# Altium schematic sheet input_output.SchDoc
size A4; SheetNumber: 2; SheetTotal: 6
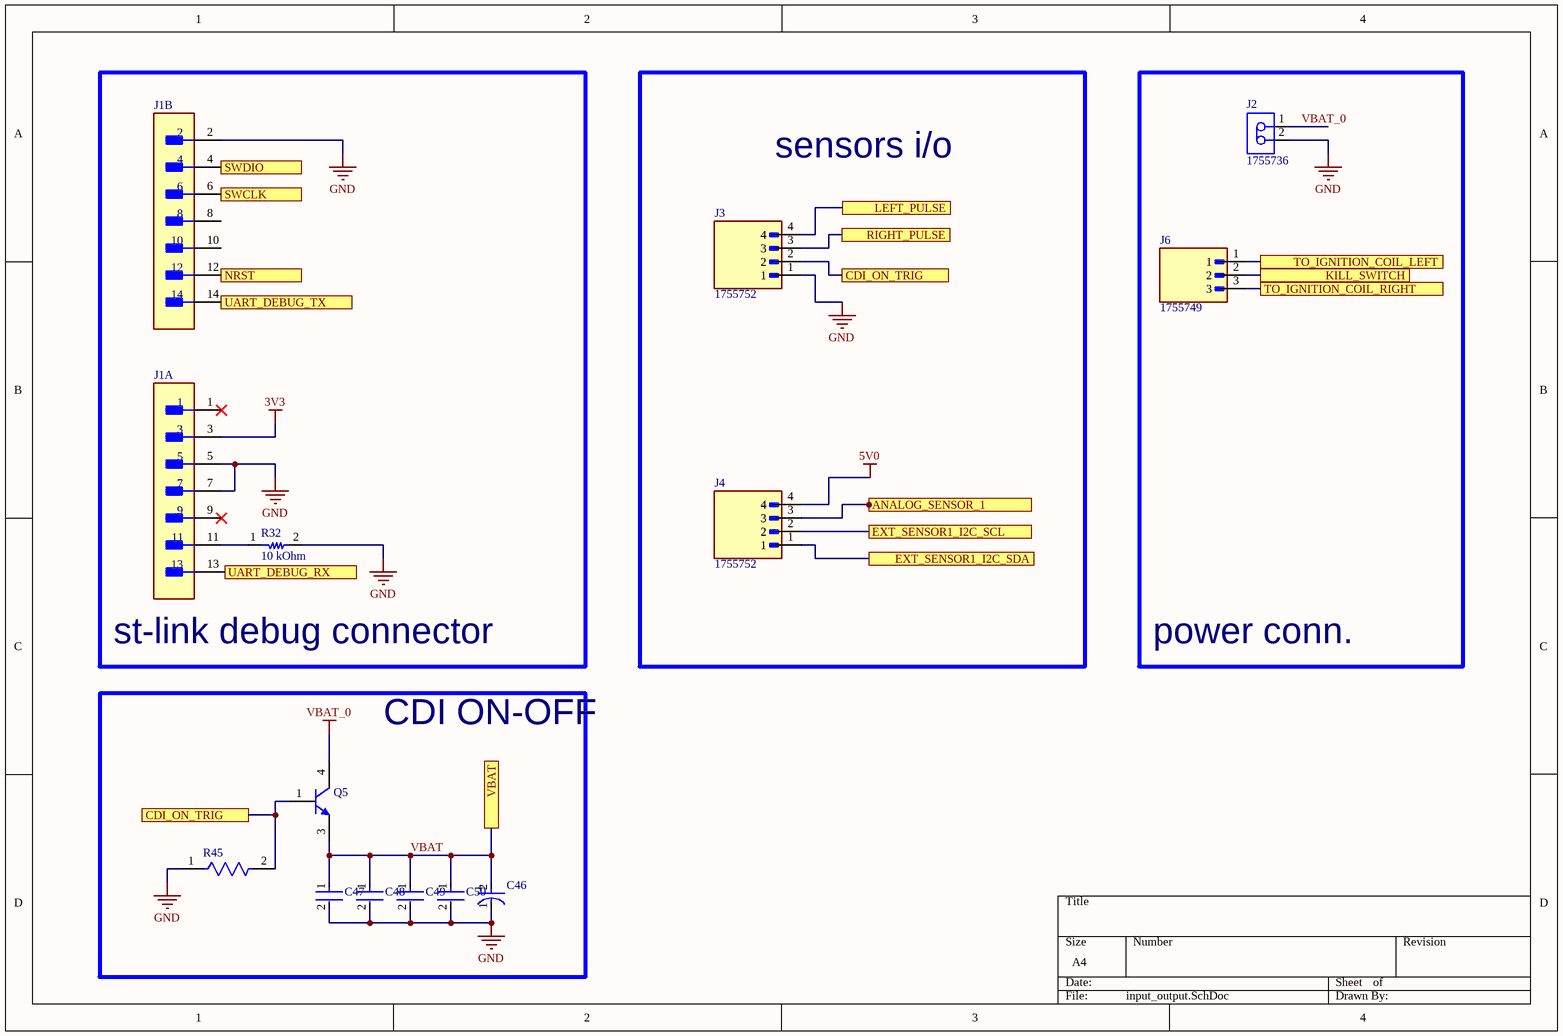
[diagram p0: input_output.SchDoc]

## Parts
C46  EEEFT1E471AP  [FP-FTF-MFG]  (value not drawn)
C47  C1206X104J3GACTU  [FP-C1206X104J3GACTU-MFG]  (value not drawn)
C48  C1206X104J3GACTU  [FP-C1206X104J3GACTU-MFG]  (value not drawn)
C49  C1206X104J3GACTU  [FP-C1206X104J3GACTU-MFG]  (value not drawn)
C50  C1206X104J3GACTU  [FP-C1206X104J3GACTU-MFG]  (value not drawn)
J1  FTSH-107-01-F-DV-K  [FP-FTSH-107-01-F-DV-K-MFG]  (value not drawn)  (parts A,B of 2)
J2  1755736  [PHOE-1755736-2_V]
J3  1755752  [PHOENIX_1755752]
J4  1755752  [PHOENIX_1755752]
J6  1755749  [PHOENIX_1755749]
Q5  MJD3055T4G  [ONSC-DPAK-3-369C-01_V]  (value not drawn)
R32  value 10 kOhm  [0603_FP]  (hidden comment: Resistor_0603)
R45  CRGP0805F10K  [FP-CRGP0805-IPC_C]  (value not drawn)

## Blocks framed on the sheet
st-link debug connector: J1 R32
sensors i/o: J3 J4
power conn.: J2 J6
CDI ON-OFF: C46-C50 Q5 R45

## Ports
ANALOG_SENSOR_1 (see logic[1A]), CDI_ON_TRIG (see input_output[1D]), CDI_ON_TRIG (see input_output[3B]), EXT_SENSOR1_I2C_SCL (see logic[3A]), EXT_SENSOR1_I2C_SDA (see logic[3A]), KILL_SWITCH (see logic[3B]), LEFT_PULSE (see input_signal_conditioning[1B]), NRST (see logic[3B]), RIGHT_PULSE (see input_signal_conditioning[1C]), SWCLK (see logic[1B]), SWDIO (see logic[1B]), TO_IGNITION_COIL_LEFT (see cd_switching[6B]), TO_IGNITION_COIL_RIGHT (see cd_switching[6C]), UART_DEBUG_RX (see logic[1B]), UART_DEBUG_TX (see logic[1B]), VBAT (see HV_power[1C], LV_power[1B])

## Nets
3V3: J1.3
5V0: J4.4
GND: C46.1(C) C47.2 C48.2 C49.2 C50.2 J1.2 J1.5 J1.7 J2.2 J3.1 R32.2 R45.1
VBAT_0: J2.1 Q5.4(C)
ANALOG_SENSOR_1: J4.3 ; port ANALOG_SENSOR_1
CDI_ON_TRIG: J3.2 Q5.1(B) R45.2 ; port CDI_ON_TRIG
EXT_SENSOR1_I2C_SCL: J4.2 ; port EXT_SENSOR1_I2C_SCL
EXT_SENSOR1_I2C_SDA: J4.1 ; port EXT_SENSOR1_I2C_SDA
KILL_SWITCH: J6.2 ; port KILL_SWITCH
LEFT_PULSE: J3.4 ; port LEFT_PULSE
NRST: J1.12 ; port NRST
RIGHT_PULSE: J3.3 ; port RIGHT_PULSE
SWCLK: J1.6 ; port SWCLK
SWDIO: J1.4 ; port SWDIO
TO_IGNITION_COIL_LEFT: J6.1 ; port TO_IGNITION_COIL_LEFT
TO_IGNITION_COIL_RIGHT: J6.3 ; port TO_IGNITION_COIL_RIGHT
UART_DEBUG_RX: J1.13 ; port UART_DEBUG_RX
UART_DEBUG_TX: J1.14 ; port UART_DEBUG_TX
VBAT: C46.2(A) C47.1 C48.1 C49.1 C50.1 Q5.3(E) ; port VBAT
NetJ1_11: J1.11 R32.1

Not connected (* = marked no-connect by the designer): J1 1* 8 9* 10

## Notes on the sheet
- (in symbol CMP-05427-000040-1) +

## Library data of the parts
C46 = CMP-05427-000040-1: CAP ALUM 470UF 20% 25V SMD; ESR (Equivalent Series Resistance): 80mR; Dielectric Material: Aluminium; Lead Diameter: 0.9mm; Ripple Current: 850mA; Leakage Current: 117.5uA; Life (Hours): 2000Hour; Lead Free: Lead Free; Height - Seated (Max): 0.413inch; Contact Plating: Tin; Voltage: 25V; Package Quantity: 500; REACH SVHC: No SVHC; Diameter: 8mm; Features: General Purpose; Voltage Rating: 25V; Radiation Hardening: No; Number of Pins: 2; Length: 10.2mm; Max Operating Temperature: 105°C; Tolerance: 20%; Lead Pitch: 3.1mm; Voltage Rating (DC): 25V; Packaging: Tape and Reel; RoHS Compliant: Yes; Series: FT; Height: 10.2mm; Capacitance: 470uF; Construction: Cylindrical; Case/Package: Radial; Mount: Surface Mount; Termination: SMD/SMT; Min Operating Temperature: -55°C; Ripple Current (AC): 850mA
C47-C50 = CMP-03020-034648-1: CAP CER 0.1UF 25V C0G/NP0 1206; RoHS Compliant: Yes
J1 = CMP-02766-001448-1: CONN HEADER SMD 14POS 1.27MM; Gender: Male; Connector Type: Male Pin; Number of Contacts: 14; Row Spacing: 0.05inch; Min Operating Temperature: -55°C; Package Quantity: 1; Lead Free: Lead Free; RoHS Compliant: Yes; Contact Material: Bronze; Contact Plating: Gold; Number of Rows: 2; Housing Material: Polymer; Contact Type: Male Pin; Series: FTSH; Max Operating Temperature: 125°C; Orientation: Straight; Number of Positions: 14; Pitch: 1.27mm; Housing Color: Black; Color: Black; Radiation Hardening: No; Length: 8.89mm; Termination: Solder; Packaging: Rail/Tube; Depth: 5.84mm; Mount: Surface Mount; Contact Mating Length: 0.12inch
J2 = CMP-2000-05300-1: Male Header, Pitch 5.08 mm, 1 x 2 Postion, Height 12 mm, Tail Length 3.9 mm, RoHS, Bulk; Manufacturer: Phoenix Contact; Content: 250pc(s); Pitch: 5.08mm; Industrial packaging: Yes; Number of contacts: 2; Manufacturer URL: http://www.phoenixcontact.com/; Datasheet Version: Apr-16; Datasheet URL: http://www.mouser.com/ds/2/324/ItemDetail_1755736-921028.pdf; Manufacturer part No.: 1755736; Type: MSTBVA2,5/2-G-5,08; Colour: Green
Q5 = CMP-1048-00146-1: Complementary Power Transistor, 3-Pin DPAK, Pb-Free, Tape and Reel; Manufacturer: On Semiconductor; Polarity: NPN; fT Min (MHz): 2; IC Continuous (A): 10; PackageVersion: Rev. E, 02/2014; ComponentLink3URL: http://www.onsemi.cn/pub_link/Collateral/369C.PDF; ComponentLink1Description: Manufacturer URL; PackageReference: DPAK-3-369C-01; ComponentLink1URL: http://www.onsemi.com/; ComponentLink3Description: Package Specification; ComponentLink2URL: http://www.onsemi.cn/pub_link/Collateral/MJD2955-D.PDF; ComponentLink2Description: Datasheet; DatasheetVersion: Rev. 13; Packing: Tape and Reel; PackageDescription: 3-Pin Flange Mount, Body 6.54 x 6.095 mm, Pitch 2.29 mm; Mounting Technology: Surface Mount; PartNumber: MJD3055T4G; RoHS: TRUE
R32 = Resistor_0603: Format: 0402; Package: 0402
R45 = CMP-03211-006861-1: CRGP 0805 10K 1%; Manufacturer: TE; Power Rating: 0.33W; Voltage Rating: 150V; Value: 10KΩ; Tolerance: 0.01; Temperature Coefficient: ±100ppm/°C; Manufacturer Part Number: CRGP0805F10K; ComponentLink2URL: https://www.mouser.com/datasheet/2/418/NG_DS_9-1773463-9_A-1358566.pdf; Temperature Range Low: -55°C; Ipc Land Pattern Name: RESC200125X55; Device Class L2: Resistors; Automotive: No; Device Class L3: Chip SMD Resistors; Composition: Thick Film; Temperature Range High: +155°C; Temperature: -55°C to +155°C; Height: 0.65mm; Series: CRGP; RoHS: TRUE; Device Class L1: Passive Components; Octopart: https://octopart.com/crgp0805f10k-te+connectivity-91018782; Package: CRGP0805; Digikey Description: CRGP 0805 10K 1%; Ambient Temperature Range High: +70°C; Lead Free: Yes; ComponentLink2Description: Datasheet; Category: Res; Resistance: 10KΩ
J3 J4 = 1755752: Package: None; Price: None; Value: *; MP: 1755752; Availability: Unavailable
J6 = 1755749: Package: None; Price: None; Value: *; MP: 1755749; Availability: Unavailable